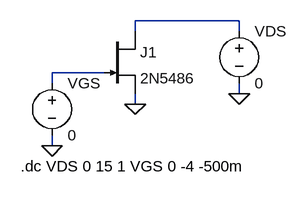
[diagram p0: schematic JFET 2N5486 Curvas Caracteristicas.asc]
JFET 2N5486 Curvas Caracteristicas.asc, the LTspice schematic file:
Version 4
SHEET 1 880 680
WIRE 384 96 224 96
WIRE 224 112 224 96
WIRE 384 112 384 96
WIRE 176 176 96 176
WIRE 96 192 96 176
WIRE 384 208 384 192
WIRE 224 224 224 208
WIRE 96 288 96 272
FLAG 384 208 0
FLAG 96 288 0
FLAG 224 224 0
SYMBOL njf 176 112 R0
SYMATTR InstName J1
SYMATTR Value 2N5486
SYMBOL voltage 384 96 R0
WINDOW 123 0 0 Left 0
WINDOW 39 0 0 Left 0
SYMATTR InstName VDS
SYMATTR Value 0
SYMBOL voltage 96 176 R0
WINDOW 123 0 0 Left 0
WINDOW 39 0 0 Left 0
SYMATTR InstName VGS
SYMATTR Value 0
TEXT 48 320 Left 2 !.dc VDS 0 15 1 VGS 0 -4 -500m

The netlist it stands for:
* JFET 2N5486 Curvas Caracteristicas.asc
J1 N001 N002 0 2N5486
VDS N001 0 0
VGS N002 0 0
.model NJF NJF
.model PJF PJF
.lib standard.jft
.dc VDS 0 15 1 VGS 0 -4 -500m
.backanno
.end